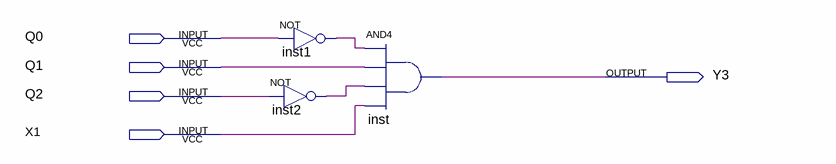
[diagram p0: schematic sheet]
// Quartus schematic Y3.bdf as structural Verilog: 3 symbols, 5 pins
module Y3 (
  input  Q0,
  input  Q1,
  input  Q2,
  input  X1,
  output Y3
);

  wire inst1_out, inst2_out;

  not inst2 (inst2_out, Q2);
  not inst1 (inst1_out, Q0);
  and inst (Y3, inst1_out, Q1, inst2_out, X1);
endmodule
